# Altium schematic sheet XDS110-TAG connector adapter.SchDoc: XDS110 - TAG Adapter
size A4; Author: DMeynen; CompanyName: DME-Projects; DrawnBy: Dmeynen; Organization: DME-Projects; Address1: Mannestraat 77; Address2: 2440 Geel; Address3: Belgium; DocumentNumber: 1; Revision: 1.0; SheetNumber: 1; SheetTotal: 1
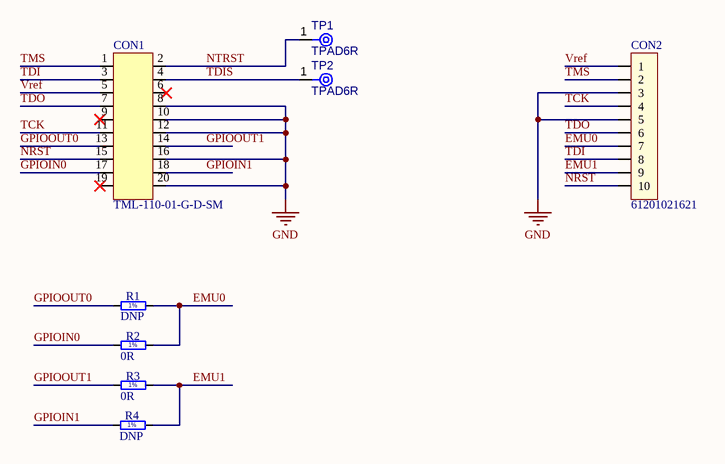
[diagram p0: XDS110-TAG connector adapter.SchDoc]

## Parts
CON1  TML-110-01-G-D-SM  [TML-110-01-G-D-SM]
CON2  61201021621  [61201021621]
R1  value DNP  [R0603]  (hidden comment: 1040)
R2  value 0R  [R0603]  (hidden comment: 1040)
R3  value 0R  [R0603]  (hidden comment: 1040)
R4  value DNP  [R0603]  (hidden comment: 1040)
TP1  TPAD6R  [TP06R]  (no BOM)
TP2  TPAD6R  [TP06R]  (no BOM)

## Nets
GND: CON1.8 CON1.10 CON1.12 CON1.16 CON1.20 CON2.3 CON2.5
EMU0: CON2.7 R1.2 R2.2
EMU1: CON2.9 R3.2 R4.2
GPIOIN0: CON1.17 R2.1
GPIOIN1: CON1.18 R4.1
GPIOOUT0: CON1.13 R1.1
GPIOOUT1: CON1.14 R3.1
NRST: CON1.15 CON2.10
NTRST: CON1.2 TP1.1(TP)
TCK: CON1.11 CON2.4
TDI: CON1.3 CON2.8
TDIS: CON1.4 TP2.1(TP)
TDO: CON1.7 CON2.6
TMS: CON1.1 CON2.2
Vref: CON1.5 CON2.1

Not connected (* = marked no-connect by the designer): CON1 6* 9* 19*

## Notes on the sheet
- Title:
- Size:
- Date:
- A4
- Author:
- Revision:
- Sheet
- of
- DME-Projects
- Mannestraat 77
- 2440 Geel
- info@dme-projects.be
- Project:
- © DME-projects 2020
- (in symbol CMP-015-001037-1) 1%

## Library data of the parts
CON1 = CMP-002-00076-2: ".050"" X .100"" Shrouded Terminal Strip"; MFG: Samtec; MFG No: TML-110-01-G-D-SM
CON2 = CMP-002-00077-2: Male Box Header WR-BHD, THT, Vertical, pitch 2.54 mm, 10 pins; MFG: Wurth Elektronik; MFG no: 61201021621
R1-R4 = CMP-015-001037-1: generic 0603 Thick film resistor; Power: 100mW; Tolerance: 0.01; Voltage: 75V; MFG no: generic; MFG: generic; Type: Thick film
TP1 TP2 = CMP-00028-00002-1: 0.6mm round; Pins: 1